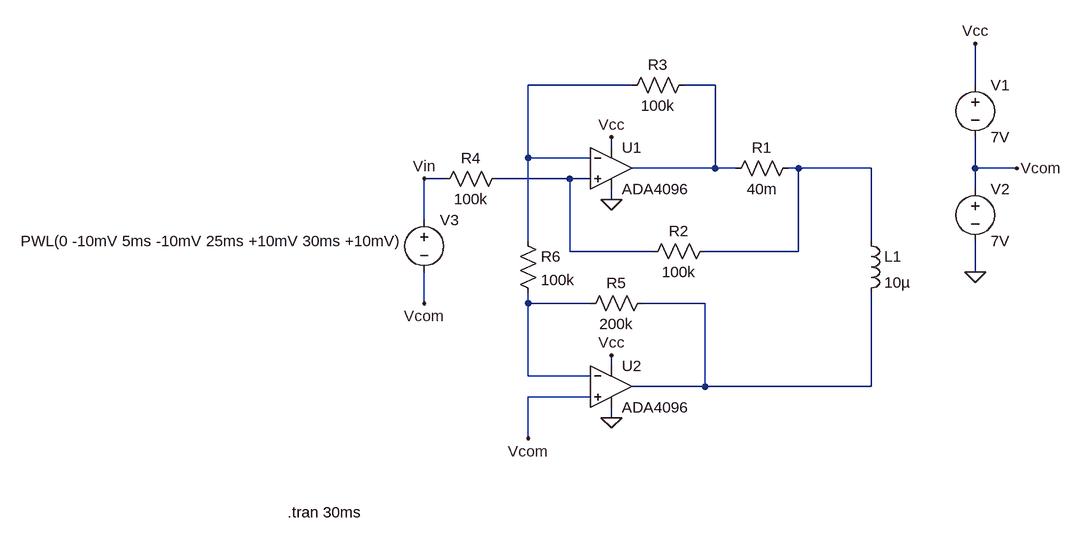
[diagram p0: schematic stdcnstcurrntdual.asc]
stdcnstcurrntdual.asc, the LTspice schematic file:
Version 4
SHEET 1 916 708
WIRE 240 32 80 32
WIRE 368 32 320 32
WIRE 768 32 768 -32
WIRE 208 128 208 112
WIRE 80 144 80 32
WIRE 176 144 80 144
WIRE 368 160 368 32
WIRE 368 160 240 160
WIRE 400 160 368 160
WIRE 496 160 480 160
WIRE 608 160 496 160
WIRE 768 160 768 112
WIRE 832 160 768 160
WIRE -48 176 -80 176
WIRE 144 176 32 176
WIRE 176 176 144 176
WIRE 768 192 768 160
WIRE 208 208 208 192
WIRE -80 240 -80 176
WIRE 80 272 80 144
WIRE 608 272 608 160
WIRE 144 288 144 176
WIRE 272 288 144 288
WIRE 496 288 496 160
WIRE 496 288 352 288
WIRE 768 320 768 272
WIRE -80 368 -80 320
WIRE 80 368 80 352
WIRE 176 368 80 368
WIRE 352 368 256 368
WIRE 208 464 208 448
WIRE 80 480 80 368
WIRE 176 480 80 480
WIRE 352 496 352 368
WIRE 352 496 240 496
WIRE 608 496 608 352
WIRE 608 496 352 496
WIRE 176 512 80 512
WIRE 208 544 208 528
WIRE 80 576 80 512
FLAG 80 576 Vcom
FLAG 832 160 Vcom
FLAG -80 368 Vcom
FLAG 768 320 0
FLAG 768 -32 Vcc
FLAG 208 208 0
FLAG 208 544 0
FLAG 208 112 Vcc
FLAG 208 448 Vcc
FLAG -80 176 Vin
SYMBOL Opamps\\ADA4096 208 96 R0
SYMATTR InstName U1
SYMBOL res 496 144 R90
WINDOW 0 0 56 VBottom 2
WINDOW 3 32 56 VTop 2
SYMATTR InstName R1
SYMATTR Value 40m
SYMBOL res 368 272 R90
WINDOW 0 0 56 VBottom 2
WINDOW 3 32 56 VTop 2
SYMATTR InstName R2
SYMATTR Value 100k
SYMBOL res 336 16 R90
WINDOW 0 0 56 VBottom 2
WINDOW 3 32 56 VTop 2
SYMATTR InstName R3
SYMATTR Value 100k
SYMBOL res 48 160 R90
WINDOW 0 0 56 VBottom 2
WINDOW 3 32 56 VTop 2
SYMATTR InstName R4
SYMATTR Value 100k
SYMBOL Opamps\\ADA4096 208 432 R0
SYMATTR InstName U2
SYMBOL res 272 352 R90
WINDOW 0 0 56 VBottom 2
WINDOW 3 32 56 VTop 2
SYMATTR InstName R5
SYMATTR Value 200k
SYMBOL res 64 256 R0
SYMATTR InstName R6
SYMATTR Value 100k
SYMBOL ind 592 256 R0
SYMATTR InstName L1
SYMATTR Value 10µ
SYMATTR SpiceLine Rser=1
SYMBOL voltage 768 16 R0
WINDOW 123 0 0 Left 0
WINDOW 39 0 0 Left 0
SYMATTR InstName V1
SYMATTR Value 7V
SYMBOL voltage 768 176 R0
WINDOW 123 0 0 Left 0
WINDOW 39 0 0 Left 0
SYMATTR InstName V2
SYMATTR Value 7V
SYMBOL voltage -80 224 R0
WINDOW 3 -621 48 Left 2
WINDOW 123 0 0 Left 0
WINDOW 39 0 0 Left 0
SYMATTR InstName V3
SYMATTR Value PWL(0 -10mV 5ms -10mV 25ms +10mV 30ms +10mV)
TEXT -290 690 Left 2 !.tran 30ms

The netlist it stands for:
* stdcnstcurrntdual.asc
XU1 N004 N001 Vcc 0 N002 ADA4096  ; pins In+ In- V+ V- OUT
R1 N003 N002 40m
R2 N003 N004 100k
R3 N002 N001 100k
R4 N004 Vin 100k
XU2 Vcom N005 Vcc 0 N006 ADA4096  ; pins In+ In- V+ V- OUT
R5 N006 N005 200k
R6 N001 N005 100k
L1 N003 N006 10µ Rser=1
V1 Vcc Vcom 7V
V2 Vcom 0 7V
V3 Vin Vcom PWL(0 -10mV 5ms -10mV 25ms +10mV 30ms +10mV)
.tran 30ms
.backanno
.end